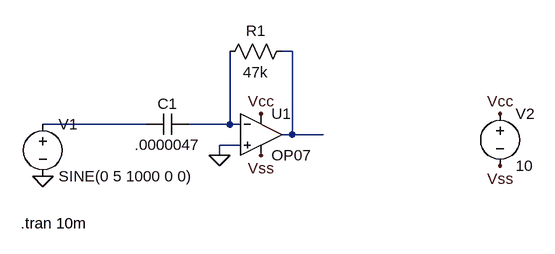
[diagram p0: schematic Differential.asc]
Differential.asc, the LTspice schematic file:
Version 4
SHEET 1 880 680
WIRE 256 48 240 48
WIRE 32 160 -128 160
WIRE 160 160 160 48
WIRE 160 160 96 160
WIRE 176 160 160 160
WIRE 256 176 256 48
WIRE 256 176 240 176
WIRE 304 176 256 176
WIRE 176 192 144 192
WIRE 144 208 144 192
FLAG 144 208 0
FLAG 576 144 Vcc
FLAG 208 144 Vcc
FLAG 576 224 Vss
FLAG 208 208 Vss
FLAG -128 240 0
SYMBOL Opamps\\OP07 208 112 R0
SYMATTR InstName U1
SYMBOL cap 96 144 R90
WINDOW 0 0 32 VBottom 2
WINDOW 3 32 32 VTop 2
SYMATTR InstName C1
SYMATTR Value .0000047
SYMBOL res 256 32 R90
WINDOW 0 0 56 VBottom 2
WINDOW 3 32 56 VTop 2
SYMATTR InstName R1
SYMATTR Value 47k
SYMBOL voltage -128 144 R0
WINDOW 123 0 0 Left 0
WINDOW 39 0 0 Left 0
SYMATTR InstName V1
SYMATTR Value SINE(0 5 1000 0 0)
SYMBOL voltage 576 128 R0
WINDOW 123 0 0 Left 0
WINDOW 39 0 0 Left 0
SYMATTR InstName V2
SYMATTR Value 10
TEXT -162 312 Left 2 !.tran 10m

The netlist it stands for:
* Differential.asc
XU1 0 N003 Vcc Vss N001 LT1001  ; OP07, pins In+ In- V+ V- OUT
C1 N003 N002 .0000047
R1 N001 N003 47k
V1 N002 0 SINE(0 5 1000 0 0)
V2 Vcc Vss 10
.tran 10m
.lib LTC.lib
.backanno
.end